# Altium schematic sheet CD4007_with_mux.SchDoc: CD4007 with mux
size A3
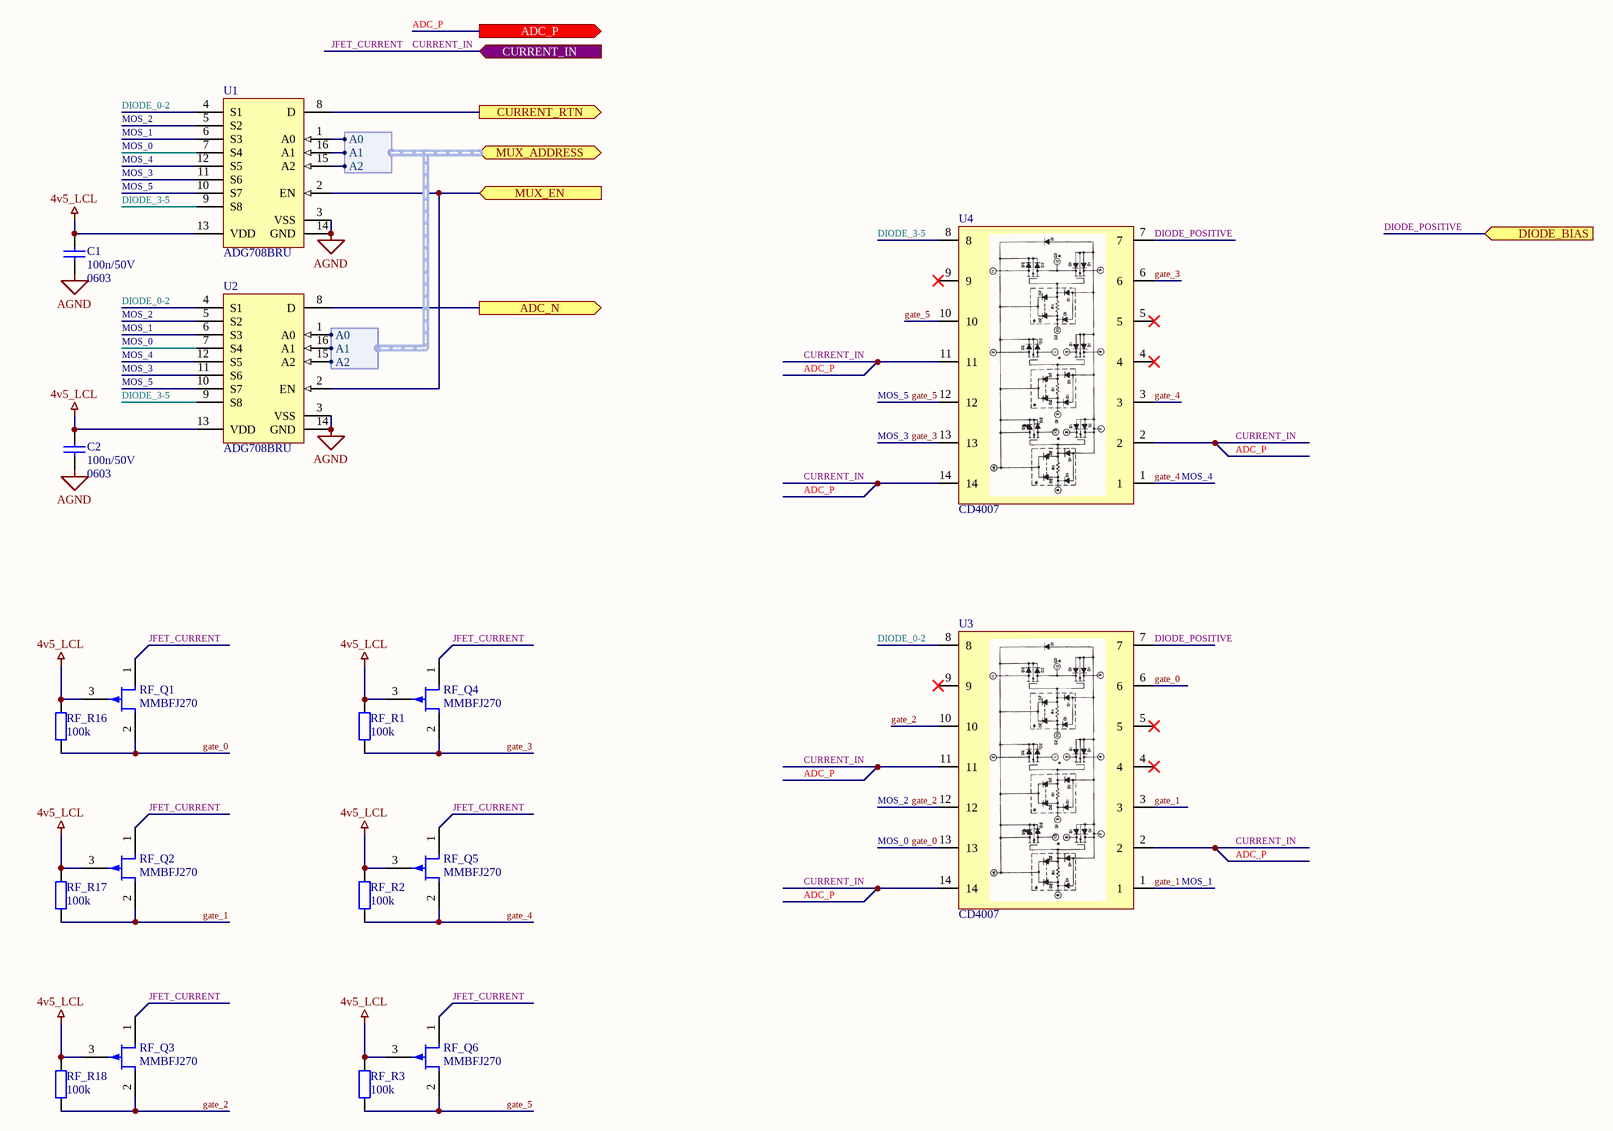
[diagram p0: CD4007_with_mux.SchDoc]

## Parts
C1  Package: 0603  [SMD_Capacitor_0603]  (hidden comment: 100n/50V)
C2  Package: 0603  [SMD_Capacitor_0603]  (hidden comment: 100n/50V)
RF_Q1  MMBFJ270  [SOT23-3]
RF_Q2  MMBFJ270  [SOT23-3]
RF_Q3  MMBFJ270  [SOT23-3]
RF_Q4  MMBFJ270  [SOT23-3]
RF_Q5  MMBFJ270  [SOT23-3]
RF_Q6  MMBFJ270  [SOT23-3]
RF_R1  100k  [SMD_Resistor_0603]
RF_R2  100k  [SMD_Resistor_0603]
RF_R3  100k  [SMD_Resistor_0603]
RF_R16  100k  [SMD_Resistor_0603]
RF_R17  100k  [SMD_Resistor_0603]
RF_R18  100k  [SMD_Resistor_0603]
U1  ADG708BRU  [ADI-RU-16_N]
U2  ADG708BRU  [ADI-RU-16_N]
U3  CD4007  [TSSOP14]
U4  CD4007  [TSSOP14]

## Ports
ADC_N (out), ADC_P (out), CURRENT_IN (in), CURRENT_RTN (out), DIODE_BIAS (in), MUX_ADDRESS (harness MUX_Address), MUX_EN (in)

## Harnesses
MUX_Address: A0, A1, A2

## Nets
4v5_LCL: C1.1 C2.1 RF_Q1.3(G) RF_Q2.3(G) RF_Q3.3(G) RF_Q4.3(G) RF_Q5.3(G) RF_Q6.3(G) RF_R1.2 RF_R2.2 RF_R3.2 RF_R16.2 RF_R17.2 RF_R18.2 U1.13(VDD) U2.13(VDD)
AGND: C1.2 C2.2 U1.3(VSS) U1.14(GND) U2.3(VSS) U2.14(GND)
ADC_N: U2.8(D) ; port ADC_N
ADC_P: RF_Q1.1(D) RF_Q2.1(D) RF_Q3.1(D) RF_Q4.1(D) RF_Q5.1(D) RF_Q6.1(D) U3.2 U3.11 U3.14 U4.2 U4.11 U4.14 ; port CURRENT_IN, port ADC_P  [also labelled CURRENT_IN, JFET_CURRENT]
CURRENT_RTN: U1.8(D) ; port CURRENT_RTN
DIODE_0-2: U1.4(S1) U2.4(S1) U3.8
DIODE_3-5: U1.9(S8) U2.9(S8) U4.8
DIODE_POSITIVE: U3.7 U4.7 ; port DIODE_BIAS
gate_0: RF_Q1.2(S) RF_R16.1 U1.7(S4) U2.7(S4) U3.6 U3.13  [also labelled MOS_0]
gate_1: RF_Q2.2(S) RF_R17.1 U1.6(S3) U2.6(S3) U3.1 U3.3  [also labelled MOS_1]
gate_2: RF_Q3.2(S) RF_R18.1 U1.5(S2) U2.5(S2) U3.10 U3.12  [also labelled MOS_2]
gate_3: RF_Q4.2(S) RF_R1.1 U1.11(S6) U2.11(S6) U4.6 U4.13  [also labelled MOS_3]
gate_4: RF_Q5.2(S) RF_R2.1 U1.12(S5) U2.12(S5) U4.1 U4.3  [also labelled MOS_4]
gate_5: RF_Q6.2(S) RF_R3.1 U1.10(S7) U2.10(S7) U4.10 U4.12  [also labelled MOS_5]
MUX_EN: U1.2(EN) U2.2(EN) ; port MUX_EN
NetU1_1: U1.1(A0) U2.1(A0) ; port MUX_ADDRESS.A0
NetU1_15: U1.15(A2) U2.15(A2) ; port MUX_ADDRESS.A2
NetU1_16: U1.16(A1) U2.16(A1) ; port MUX_ADDRESS.A1

Not connected (* = marked no-connect by the designer): U3 4* 5* 9*; U4 4* 5* 9*

## Notes on the sheet
- Title:
- Sheet:
- of
- Author:
- Model:
- Document Number:
- Checked by:
- Iss-Rev:
- Approved by:
- Date:
- File name:

## Library data of the parts
C1 C2 = Cer_C0603T104K5RALTU: Ceramic Cap Kemet COTS 100n/50V X7R 0603; Manufacturer: Kemet; ManufacturerPartNumber: C0603T104K5RALTU; Value: 100n/50V
RF_Q1-RF_Q6 = MMBFJ270: JFET, P-Channel, 3-Pin SOT-23, Pb-Free, Tape and Reel; Manufacturer: On Semiconductor; PackageDescription: 3-Pin Small Outline Transistor, Body 2.92 x 1.3 mm, Pitch 0.95 mm; RoHS: Pb-Free; Mounting Technology: Surface Mount; PartNumber: MMBFJ270; ComponentLink1Description: Manufacturer URL; ComponentLink1URL: http://www.onsemi.com/; ComponentLink2Description: Datasheet; ComponentLink2URL: http://www.onsemi.com/pub_link/Collateral/MMBFJ177LT1-D.PDF; ComponentLink3Description: Package Specification
RF_R1-RF_R3 RF_R16-RF_R18 = Res: Value: 100k; Package: 0603
U1 U2 = ADG708BRU: 1.8 to 5.5 V / +/-2.5 V, CMOS Low Voltage 3 Ohm, 8-Channel Multiplexer, -40 to 125 degC, 16-pin SOP (RU-16), Tube; Manufacturer: Analog Devices; Bandwidth (Hz): 55M; Max Analog Signal Range: Vss to Vdd; Ron (ohms): 3; Supply V Guar Performance: Dual_(+/-2.5V), Single_(+3V), Single_(+5V); t transition (s): 14n; DatasheetVersion: Rev. C; PackageVersion: Nov-02; PackageReference: RU-16; PackageDescription: 16-Pin Thin Shrink Small Outline Package, Body 5 x 4.4 mm, Pitch 0.65 mm; Supplier 1: Digi-Key; Supplier Part Number 1: ADG708BRU-ND; Supplier 2: Mouser; Supplier Part Number 2: 584-ADG708BRU; Packing: Tube; Mounting Technology: Surface Mount; Code_JEDEC: MO-153AB; PartNumber: ADG708BRU; ComponentLink1Description: Manufacturer URL; ComponentLink1URL: http://www.analog.com/en/index.html; ComponentLink2Description: Datasheet; ComponentLink2URL: http://www.analog.com/static/imported-files/data_sheets/ADG708_709.pdf; ComponentLink3Description: Package Specification; ComponentLink3URL: http:/www.analog.com/static/imported-files/packages/36244347913743854010197452789RU16.pdf
U3 U4 = CD4007: CMOS Dual Complementary Pair Plus Inverter; ComponentLink1URL: http://www.mouser.com/catalog/specsheets/AT45DB041D.pdf; ComponentLink1Description: Datasheet